# Altium schematic sheet Dcdc.12V0.+6V5.SchDoc
size A4
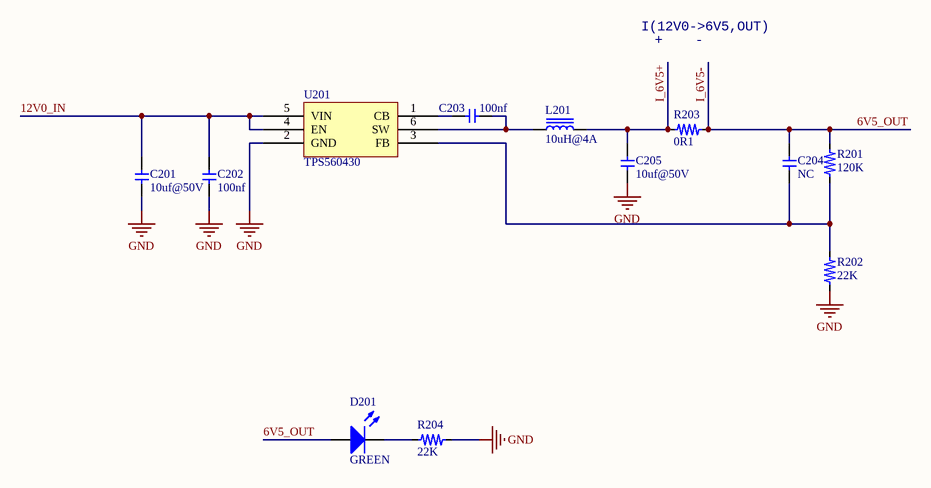
[diagram p0: Dcdc.12V0.+6V5.SchDoc]

## Parts
C201  value 10uf@50V  [C1210]  (hidden comment: Cap)
C202  value 100nf  [C0603]  (hidden comment: Cap)
C203  value 100nf  [C0603]  (hidden comment: Cap)
C204  value NC  [C0603]  (hidden comment: Cap)
C205  value 10uf@50V  [C1210]  (hidden comment: Cap)
D201  value GREEN  [LED0603]  (hidden comment: LED)
L201  value 10uH@4A  [L06063]  (hidden comment: Inductor Iron)
R201  value 120K  [R0603]  (hidden comment: Res)
R202  value 22K  [R0603]  (hidden comment: Res)
R203  value 0R1  [R1206]  (hidden comment: Res)
R204  value 22K  [R0603]  (hidden comment: Res)
U201  TPS560430  [TPS560430-SOT23-6]

## Nets
GND: C201.1 C202.1 C205.1 R202.1 R204.1 U201.2(GND)
6V5_OUT: C204.1 D201.1(A) R201.2 R203.2  [also labelled I_6V5-]
12V0_IN: C201.2 C202.2 U201.4(EN) U201.5(VIN)
I_6V5+: C205.2 L201.2 R203.1
NetC203_1: C203.1 L201.1 U201.6(SW)
NetC203_2: C203.2 U201.1(CB)
NetC204_2: C204.2 R201.1 R202.2 U201.3(FB)
NetD201_2: D201.2(K) R204.2

## Notes on the sheet
- I(12V0->6V5,OUT)
- +
- -

## Library data of the parts
L201 = Inductor Iron: Magnetic-Core Inductor
R201-R204 = Res: 电阻
U201 = TPS560430: TPS560430 SIMPLE SWITCHER® 4-V to 36-V, 600-mA Synchronous Step-Down Converter